# EAGLE design control_board (EAGLE 7.1.0)
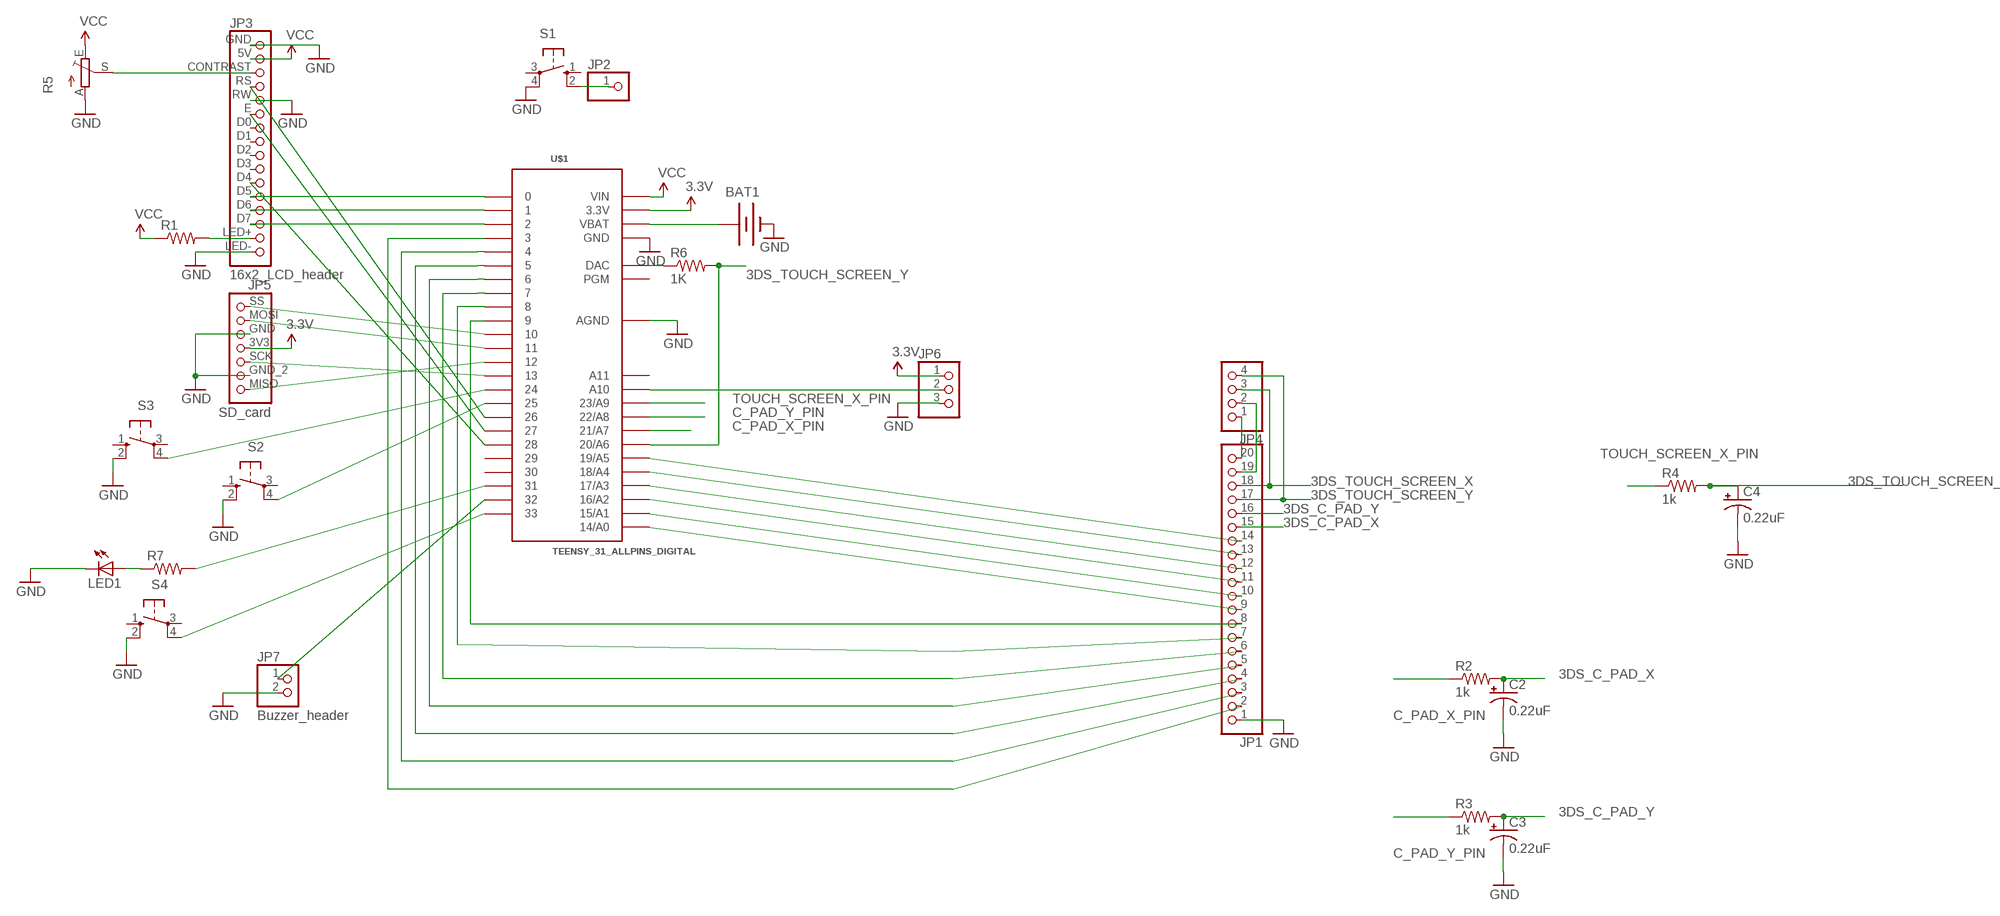
[diagram p0: schematic, sheet 1]

## Parts
BAT1  BATTERY20PTH  [BATTCOM_20MM_PTH]
C2  0.22uF  10UF-25V-20%(PTH)  [CPOL-RADIAL-10UF-25V]
C3  0.22uF  10UF-25V-20%(PTH)  [CPOL-RADIAL-10UF-25V]
C4  0.22uF  10UF-25V-20%(PTH)  [CPOL-RADIAL-10UF-25V]
JP1  PINHD-1X20  [1X20]
JP2  PINHD-1X1  [1X01]
JP3  16x2_LCD_header  PINHD-1X16  [1X16]
JP4  PINHD-1X4  [1X04]
JP5  SD_card  PINHD-1X7  [1X07]
JP6  PINHD-1X3  [1X03]
JP7  Buzzer_header  PINHD-1X2  [1X02]
LED1  LED5MM  [LED5MM]
R1  RESISTOREZ  [AXIAL-0.3EZ]
R2  1k  RESISTORPTH-1/4W-VERT  [AXIAL-0.1]
R3  1k  RESISTORPTH-1/4W-VERT  [AXIAL-0.1]
R4  1k  RESISTORPTH-1/4W-VERT  [AXIAL-0.1]
R5  TRIM_EU-CA6V  [CA6V]
R6  1K  RESISTORPTH-1/4W-VERT  [AXIAL-0.1]
R7  RESISTOREZ  [AXIAL-0.3EZ]
S1  10-XX  [B3F-10XX]
S2  10-XX  [B3F-10XX]
S3  10-XX  [B3F-10XX]
S4  10-XX  [B3F-10XX]
U$1  TEENSY_31_ALLPINS_DIGITAL  [TEENSY_31_ALLPINS_DIGITAL]

## Nets
3.3V: JP5.3V3 JP6.1 U$1.3.3V
3DS_C_PAD_X: C2.1(+) JP1.15 R2.P$2
3DS_C_PAD_Y: C3.1(+) JP1.16 R3.P$2
3DS_TOUCH_SCREEN_X: C4.1(+) JP1.18 JP4.3 R4.P$2
3DS_TOUCH_SCREEN_Y: JP1.17 JP4.4 R6.P$2 U$1.20/A6
C_PAD_X_PIN: R2.P$1 U$1.21/A7
C_PAD_Y_PIN: R3.P$1 U$1.22/A8
GND: BAT1.2(-) C2.2(-) C3.2(-) C4.2(-) JP1.1 JP3.GND JP3.LED- JP3.RW JP5.GND JP5.GND_2 JP6.3 JP7.2 LED1.K(C) R5.A S1.4(P1) S2.2(S1) S3.2(S1) S4.2(S1) U$1.AGND U$1.GND
N$1: JP1.7 U$1.8
N$2: JP1.8 U$1.9
N$3: JP1.9 U$1.14/A0
N$4: JP1.10 U$1.15/A1
N$5: JP1.11 U$1.16/A2
N$6: JP1.12 U$1.17/A3
N$7: JP1.13 U$1.18/A4
N$8: JP1.14 U$1.19/A5
N$9: JP3.LED+ R1.P$2
N$10: JP3.CONTRAST R5.S
N$11: JP5.SS U$1.10
N$12: JP5.MOSI U$1.11
N$13: JP5.MISO U$1.12
N$14: JP2.1 S1.2(S1)
N$15: JP5.SCK U$1.13
N$16: JP6.2 U$1.A10
N$17: JP3.D7 U$1.2
N$18: JP3.D6 U$1.1
N$19: JP3.D5 U$1.0
N$20: JP3.D4 U$1.28
N$21: JP3.E U$1.27
N$22: JP1.2 U$1.3
N$23: JP1.3 U$1.4
N$24: JP1.4 U$1.5
N$25: JP1.5 U$1.6
N$26: JP1.6 U$1.7
N$27: R6.P$1 U$1.RESET(DAC)
N$28: JP3.RS U$1.26
N$29: BAT1.1(+) U$1.VBAT
N$30: S2.4(P1) U$1.25
N$31: S3.4(P1) U$1.24
N$32: S4.4(P1) U$1.33
N$33: R7.P$2 U$1.31
N$34: JP1.20 JP4.1
N$35: JP1.19 JP4.2
N$36: LED1.A R7.P$1
N$37: JP7.1 U$1.32
TOUCH_SCREEN_X_PIN: R4.P$1 U$1.23/A9
VCC: JP3.5V R1.P$1 R5.E U$1.VIN
Unconnected: JP3.D0 JP3.D1 JP3.D2 JP3.D3 S1.1(S) S1.3(P) S2.1(S) S2.3(P) S3.1(S) S3.3(P) S4.1(S) S4.3(P) U$1.29 U$1.30 U$1.A11 U$1.PGM

## Library data of the parts
BAT1 = SparkFun-Electromechanical:BATTERY: Battery Holders Various common sizes : AA, AAA, 20mm coin cell and 12mm coin cell. 20MM_4LEGS, BATT-10373
C2-C4 = SparkFun-Capacitors:10UF-25V-20%(PTH): CAP-08440; PROD_ID: CAP-08440
JP1 = pinhead:PINHD-1X20: PIN HEADER
JP2 = pinhead:PINHD-1X1: PIN HEADER
JP3 = LCD_HEADER:PINHD-1X16: PIN HEADER
JP4 = pinhead:PINHD-1X4: PIN HEADER
JP5 = sd_header:PINHD-1X7: PIN HEADER
JP6 = pinhead:PINHD-1X3: PIN HEADER
JP7 = pinhead:PINHD-1X2: PIN HEADER
LED1 = adafruit:LED: LED OSRAM: - CHIPLED LG R971, LG N971, LY N971, LG Q971, LY Q971, LO R971, LY R971 LH N974, LH R974 LS Q976, LO Q976, LY Q976 LO Q996 - Hyper CHIPLED LW Q18S LB Q993, LB Q99A, LB R99A - SideLED LS A670, LO A670, LY A670, LG A670, LP A670 LB A673, LV A673, LT A673, LW A673 LH A674 LY A675 LS A676, LA A676, LO A676, LY A676, LW A676 LS A679, LY A679, LG A679 - Hyper Micro SIDELED® LS Y876, LA Y876, LO Y876, LY Y876 LT Y87S - SmartLED LW L88C, LW L88S LB L89C, LB L89S, LG L890 LS L89K, LO L89K, LY L89K LS L896, LA L896, LO L896, LY L896 - TOPLED LS T670, LO T670, LY T670, LG T670, LP T670 LSG T670, LSP T670, LSY T670, LOP T670, LYG T670 LG T671, LOG T671, LSG T671 LB T673, LV T673, LT T673, LW T673 LH T674 LS T676, LA T676, LO T676, LY T676, LB T676, LH T676, LSB T676, LW T676 LB T67C, LV T67C, LT T67C, LS T67K, LO T67K, LY T67K, LW E67C LS E67B, LA E67B, LO E67B, LY E67B, LB E67C, LV E67C, LT E67C LW T67C LS T679, LY T679, LG T679 LS T770, LO T770, LY T770, LG T770, LP T770 LB T773, LV T773, LT T773, LW T773 LH T774 LS E675, LA E675, LY E675, LS T675 LS T776, LA T776, LO T776, LY T776, LB T776 LHGB T686 LT T68C, LB T68C - Hyper Mini TOPLED® LB M676 - Mini TOPLED Santana® LG M470 LS M47K, LO M47K, LY M47K Source: http://www.osram.convergy.de/
R1-R4 R6 R7 = SparkFun-Resistors:RESISTOR: Resistor Basic schematic elements and footprints for 0603, 1206, and PTH resistors.
R5 = pot:TRIM_EU-: POTENTIOMETER
S1-S4 = switch-omron:10-XX: OMRON SWITCH; MPN: B3F-1000; OC_FARNELL: 176432; OC_NEWARK: 36M3542
U$1 = Teensy3.0:TEENSY_31_ALLPINS_DIGITAL

## Board
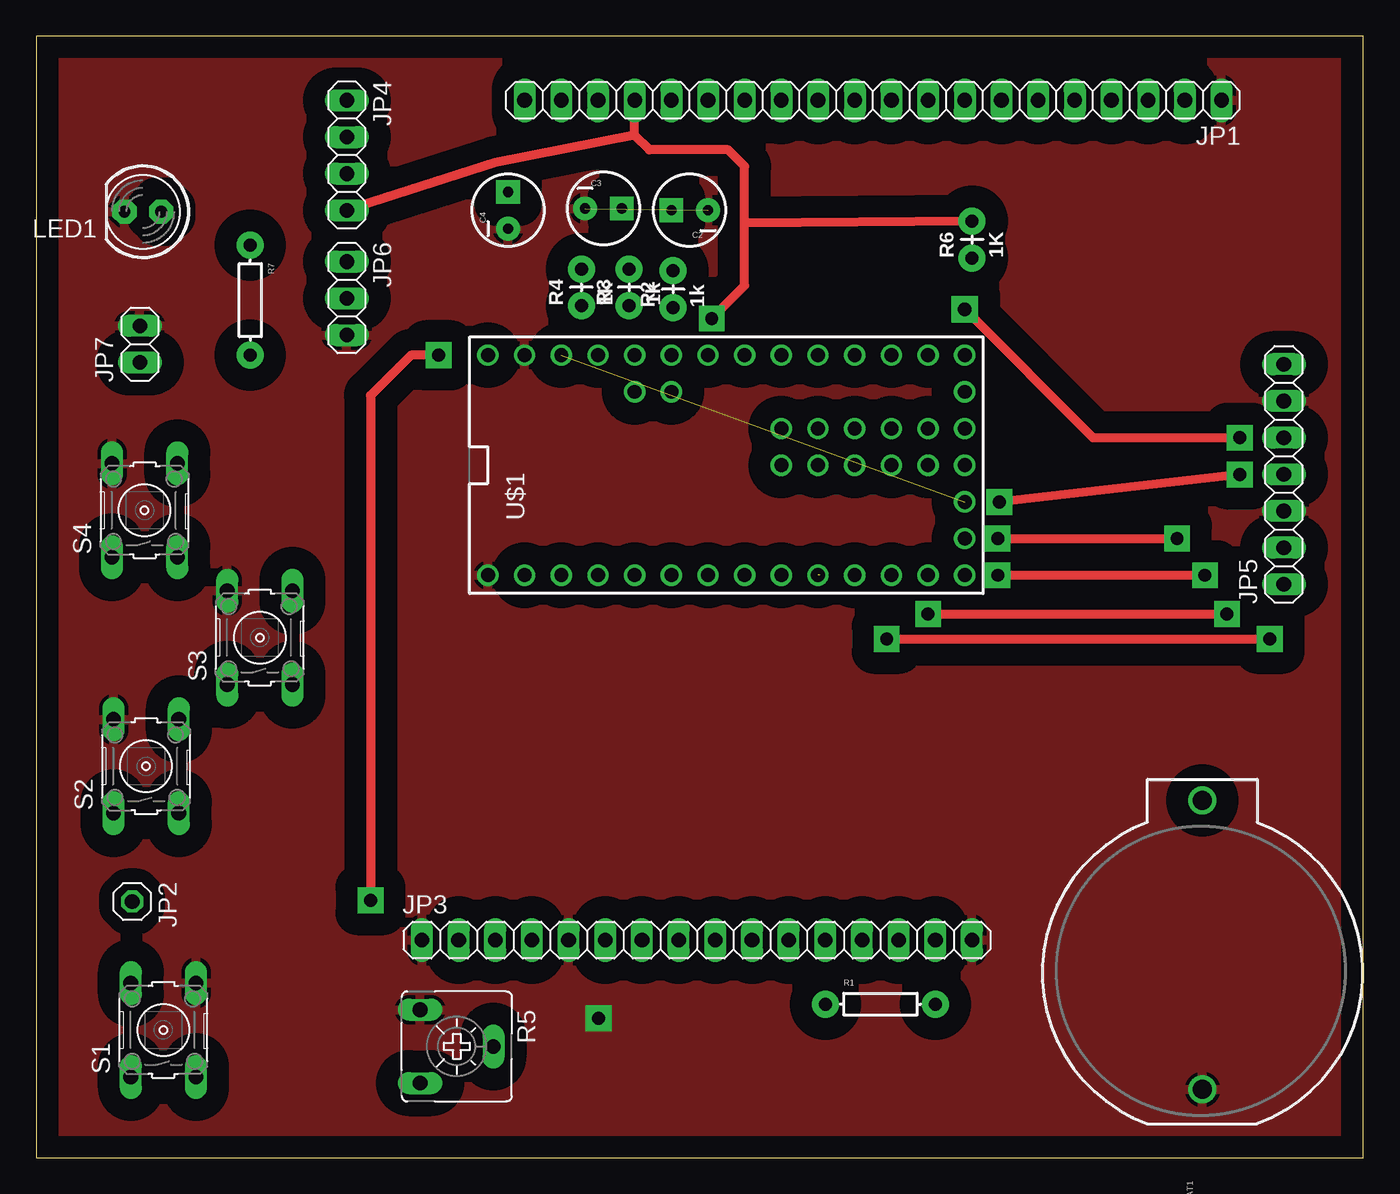
[diagram p1: board, top side]
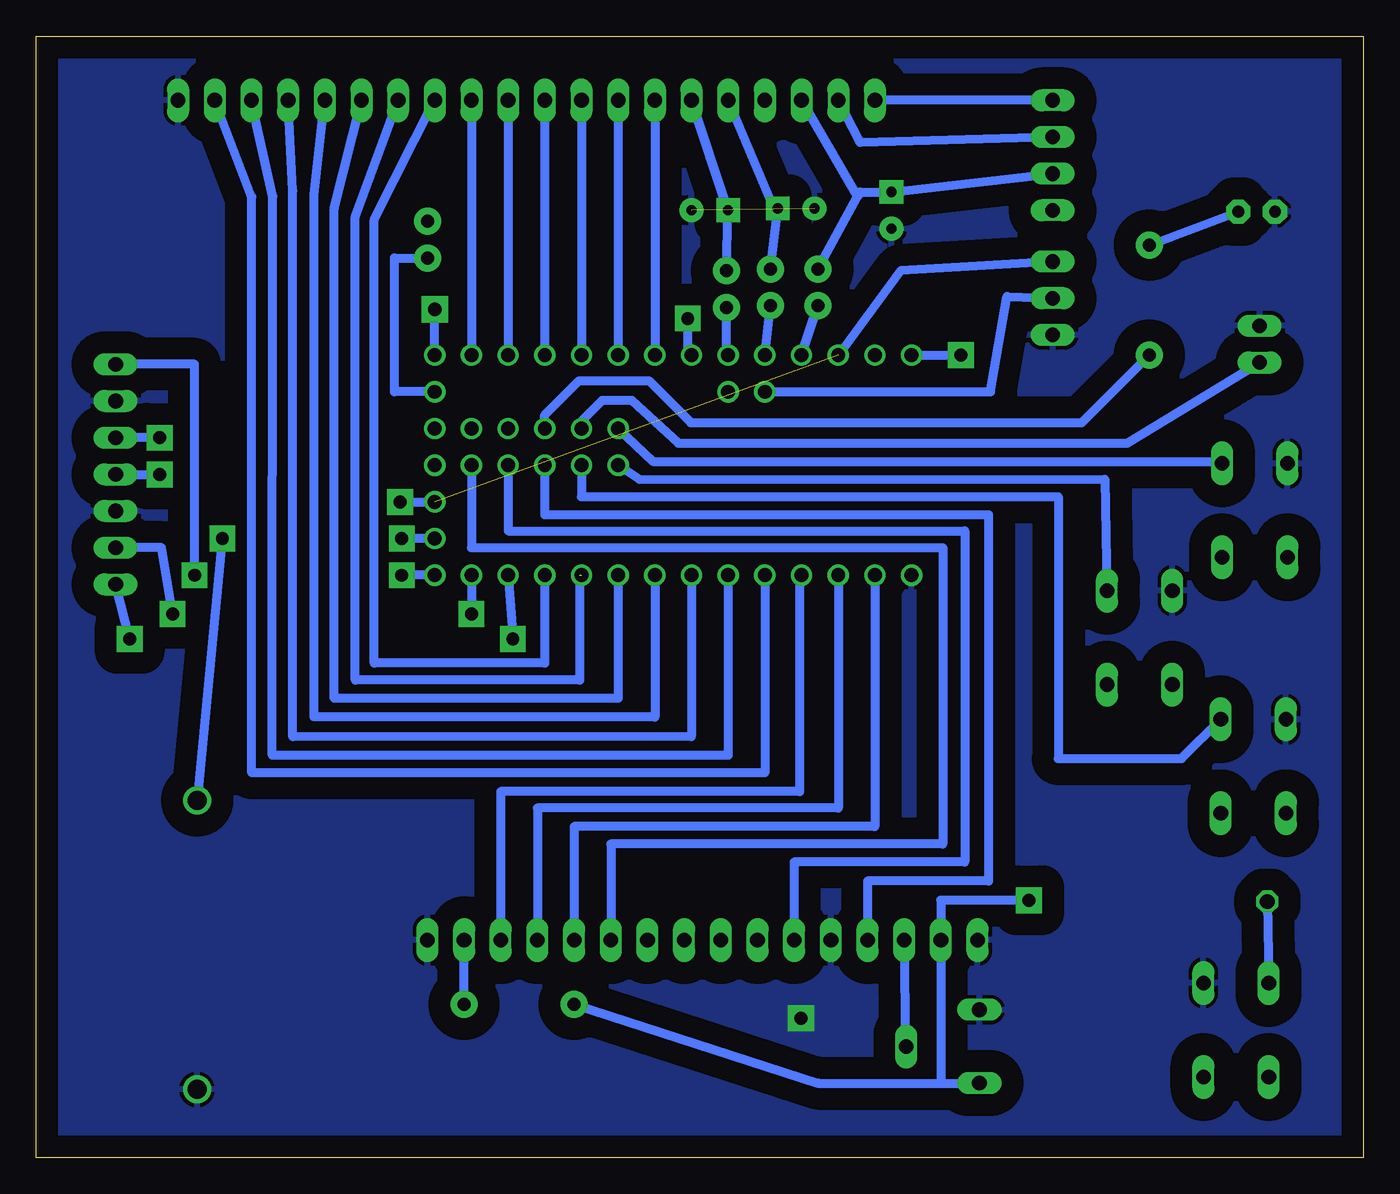
[diagram p2: board, bottom side, seen from below]

Size 91.92 x 77.67 mm. Coordinates in mm from the lower left corner, seen from the top.
Outline: 0,0 91.92,0 91.92,77.67 0,77.67 0,0
Copper layers (1*16): Top 0.035mm / dielectric 1.5mm / Bottom 0.035mm
Design rules "MWSEagleDesignRules2": minimum track width 13mil, minimum drill 22mil, track to track 13mil, track to pad 13mil, pad to pad 13mil, via to via 13mil, smd to smd 8mil, copper to edge 40mil, drill to drill 8mil, minimum pad ring 10mil, minimum via ring 8mil, stop-mask expansion 4mil, vias tented up to drill 0mil, thermal gap 10mil

### Footprints (pad centres in the part's own frame; a part is rotated, then mirrored left to right if it is on the bottom)
BATTCOM_20MM_PTH = drill 1.3: 1 11.85,0; 2 -8.15,0
CPOL-RADIAL-10UF-25V = drill 0.7 pad 1.651 square: 1 1.27,0 | drill 0.7 pad 1.651: 2 -1.27,0
1X20 = drill 1.016 long: 1 -24.13,0; 2 -21.59,0; 3 -19.05,0; 4 -16.51,0; 5 -13.97,0; 6 -11.43,0; 7 -8.89,0; 8 -6.35,0; 9 -3.81,0; 10 -1.27,0; 11 1.27,0; 12 3.81,0; 13 6.35,0; 14 8.89,0; 15 11.43,0; 16 13.97,0; 17 16.51,0; 18 19.05,0; 19 21.59,0; 20 24.13,0
1X01 = drill 1.016 octagon: 1 0,0
1X16 = drill 1.016 long: 5V -16.51,0; CONTRAST -13.97,0; D0 -3.81,0; D1 -1.27,0; D2 1.27,0; D3 3.81,0; D4 6.35,0; D5 8.89,0; D6 11.43,0; D7 13.97,0; E -6.35,0; GND -19.05,0; LED+ 16.51,0; LED- 19.05,0; RS -11.43,0; RW -8.89,0
1X04 = drill 1.016 long: 1 -3.81,0; 2 -1.27,0; 3 1.27,0; 4 3.81,0
1X07 = drill 1.016 long: 3V3 0,0; GND -2.54,0; GND_2 5.08,0; MISO 7.62,0; MOSI -5.08,0; SCK 2.54,0; SS -7.62,0
1X03 = drill 1.016 long: 1 -2.54,0; 2 0,0; 3 2.54,0
1X02 = drill 1.016 long: 1 -1.27,0; 2 1.27,0
LED5MM = drill 0.813 pad 1.676 octagon: A -1.27,0; K 1.27,0
AXIAL-0.3EZ = drill 0.9 pad 1.88: P$1 -3.81,0; P$2 3.81,0
AXIAL-0.1 = drill 0.9 pad 1.88: P$1 0,0; P$2 2.54,0
CA6V = drill 1.016 long: A -2.54,-2.54; E 2.54,-2.54; S 0,2.54
B3F-10XX = drill 1.016 long: 1 -3.251,2.261; 2 3.251,2.261; 3 -3.251,-2.261; 4 3.251,-2.261
TEENSY_31_ALLPINS_DIGITAL = drill 0.965: 0 -7.62,15.24; 1 -7.62,12.7; 2 -7.62,10.16; 3 -7.62,7.62; 3.3V 7.62,12.7; 3.3V1 -2.54,-15.24; 4 -7.62,5.08; 5 -7.62,2.54; 6 -7.62,0; 7 -7.62,-2.54; 8 -7.62,-5.08; 9 -7.62,-7.62; 10 -7.62,-10.16; 11 -7.62,-12.7; 12 -7.62,-15.24; 13 7.62,-15.24; 14/A0 7.62,-12.7; 15/A1 7.62,-10.16; 16/A2 7.62,-7.62; 17/A3 7.62,-5.08; 18/A4 7.62,-2.54; 19/A5 7.62,0; 20/A6 7.62,2.54; 21/A7 7.62,5.08; 22/A8 7.62,7.62; 23/A9 7.62,10.16; 24 0,-2.54; 25 0,-5.08; 26 0,-7.62; 27 0,-10.16; 28 0,-12.7; 29 2.54,-12.7; 30 2.54,-10.16; 31 2.54,-7.62; 32 2.54,-5.08; 33 2.54,-2.54; A10 5.08,7.62; A11 5.08,5.08; AGND 7.62,15.24; GND -7.62,17.78; GND1 0,-15.24; PGM 2.54,-15.24; RESET 5.08,-15.24; VBAT -5.08,-15.24; VIN 7.62,17.78

### Placement (x,y rotation side)
BAT1  80.77,12.88 90 top
C2  45.26,65.61 180 top
C3  39.29,65.74 0 top
C4  32.69,65.61 90 top
JP1  57.96,73.23 180 top
JP2  6.65,17.73 270 top
JP3  45.77,15.06 0 top
JP4  21.51,69.42 270 top
JP5  86.41,47.32 90 top
JP6  21.51,59.51 270 top
JP7  7.19,56.34 90 top
LED1  7.39,65.51 180 top
R1  58.47,10.62 0 top
R2  44.12,58.88 90 top
R3  41.07,59 90 top
R4  37.77,59 90 top
R5  29.13,7.7 270 top
R6  64.82,62.31 90 top
R7  14.83,59.39 270 top
S1  8.81,8.84 90 top
S2  7.62,27.1 90 top
S3  15.49,36.02 90 top
S4  7.52,44.83 90 top
U$1  49.07,47.96 90 top

### Tracks (layer width: path | path; a pad name or v marks a point on that pad's centre or on a via)
3.3V  (via drill 0.9 pad 1.42)  (1 unrouted)
  Top 0.61: v83.36,47.32 v66.73,45.41
  Bottom 0.61: JP5.3V3 v83.36,47.32 | v66.73,45.41 64.31,45.41 | JP6.1 32.05,61.42 U$1.3.3V
3DS_C_PAD_X
  Bottom 0.61: R2.P$2 C2.1 JP1.15
3DS_C_PAD_Y
  Bottom 0.61: R3.P$2 40.63,65.2 | 40.63,65.2 C3.1 | JP1.16 40.63,65.2
3DS_TOUCH_SCREEN_X
  Bottom 0.61: R4.P$2 35.02,66.56 | 35.02,66.56 34.85,66.88 C4.1 JP4.3 | JP1.18 35.02,66.56
3DS_TOUCH_SCREEN_Y  (via drill 0.89 pad 1.52)
  Top 0.61: v46.79,58.12 49.07,60.4 49.07,64.72 | 49.07,64.72 49.07,68.66 47.93,69.8 42.47,69.8 41.45,70.81 | 41.45,70.81 JP1.17 | 41.45,70.81 31.8,68.91 JP4.4 | R6.P$2 49.07,64.72
  Bottom 0.61: U$1.20/A6 46.79,55.58 v46.79,58.12
C_PAD_X_PIN
  Bottom 0.61: U$1.21/A7 44.12,55.58 R2.P$1
C_PAD_Y_PIN
  Bottom 0.61: U$1.22/A8 R3.P$1
GND  (via drill 0.9)  (1 unrouted)
  other vias: 38.96,9.65
  pour Bottom (isolate 1.524): -0.28,77.95 0,0 92.35,0.1 92.08,78.05
  pour Top (isolate 1.524): -0.13,0.13 92.08,-0.3 92.2,77.65 -0.1,77.8
N$1  (1 unrouted)
  Bottom 0.61: JP1.7 69.83,65.18 69.83,33.07 54.28,33.07 54.28,40.34
N$2
  Bottom 0.61: JP1.8 68.5,64.97 68.5,34.24 56.69,34.24 U$1.9
N$3
  Bottom 0.61: JP1.9 U$1.14/A0
N$4
  Bottom 0.61: JP1.10 U$1.15/A1
N$5
  Bottom 0.61: JP1.11 U$1.16/A2
N$6
  Bottom 0.61: JP1.12 U$1.17/A3
N$7
  Bottom 0.61: JP1.13 U$1.18/A4
N$8
  Bottom 0.61: JP1.14 U$1.19/A5
N$9
  Bottom 0.61: R1.P$2 JP3.LED+
N$10
  Bottom 0.61: R5.S JP3.CONTRAST
N$11  (via drill 0.89 pad 1.52)
  Top 0.61: v58.9,35.92 v85.45,35.92
  Bottom 0.61: U$1.10 v58.9,35.92 | v85.45,35.92 JP5.SS
N$12  (via drill 0.89 pad 1.52)
  Top 0.61: v61.77,37.64 v82.47,37.64
  Bottom 0.61: U$1.11 v61.77,37.64 | v82.47,37.64 83.24,42.24 JP5.MOSI
N$13  (via drill 0.89 pad 1.52)
  Top 0.61: v66.6,40.34 v80.95,40.34
  Bottom 0.61: U$1.12 v66.6,40.34 | v80.95,40.34 80.95,54.94 JP5.MISO
N$14
  Bottom 0.61: JP2.1 S1.2
N$15  (via drill 0.89 pad 1.52, 0.91 pad 1.52)
  Top 0.61: v64.31,58.75 73.2,49.86 v83.36,49.86
  Bottom 0.61: U$1.13 v64.31,58.75 | v83.36,49.86 JP5.SCK
N$16
  Bottom 0.61: U$1.A10 25.83,53.03 24.69,59.64 JP6.2
N$17
  Bottom 0.61: U$1.2 39.04,40.34 39.04,25.35 59.74,25.35 JP3.D7
N$18
  Bottom 0.61: U$1.1 36.37,24.21 57.2,24.21 JP3.D6
N$19
  Bottom 0.61: U$1.0 33.83,22.94 54.66,22.94 JP3.D5
N$20
  Bottom 0.61: U$1.28 61.77,42.24 29.13,42.24 29.13,21.72 52.12,21.72 JP3.D4
N$21
  Bottom 0.61: U$1.27 59.23,43.41 27.61,43.41 27.61,20.47 39.42,20.47 JP3.E
N$22
  Bottom 0.61: JP1.2 76.99,66.52 76.99,26.64 41.45,26.64 U$1.3
N$23
  Bottom 0.61: JP1.3 75.54,66.57 75.56,27.86 43.99,27.86 U$1.4
N$24
  Bottom 0.61: JP1.4 74.14,66.95 74.14,29.13 46.53,29.16 U$1.5
N$25
  Bottom 0.61: JP1.5 72.67,66.7 72.67,30.53 49.07,30.5 U$1.6
N$26
  Bottom 0.61: JP1.6 71.27,65.73 71.27,31.8 51.61,31.8 U$1.7
N$27
  Bottom 0.61: R6.P$1 67.11,62.31 67.11,53.03 U$1.RESET
N$28
  Bottom 0.61: U$1.26 56.69,44.53 25.96,44.53 25.96,19.15 34.34,19.15 JP3.RS
N$29  (via drill 0.89 pad 1.52)
  Top 0.61: v66.6,42.88 v79.02,42.88
  Bottom 0.61: U$1.VBAT v66.6,42.88 | v79.02,42.88 BAT1.1
N$30
  Bottom 0.61: U$1.25 54.15,45.77 21.13,45.77 21.13,27.64 12.6,27.64 S2.4
N$31
  Bottom 0.61: S3.4 17.91,46.99 50.14,46.97 U$1.24
N$32
  Bottom 0.61: U$1.33 49.2,48.21 10.29,48.21 S4.4
N$33
  Bottom 0.61: U$1.31 56.69,51.41 54.3,53.8 49.48,53.8 46.58,50.9 19.51,50.9 R7.P$2
N$34
  Bottom 0.61: JP4.1 JP1.20
N$35
  Bottom 0.61: JP4.2 34.85,70.31 JP1.19
N$36
  Bottom 0.61: R7.P$1 LED1.A
N$37
  Bottom 0.61: U$1.32 54.15,51 52.7,52.45 50.67,52.45 47.45,49.48 16.36,49.48 JP7.1
TOUCH_SCREEN_X_PIN
  Bottom 0.61: U$1.23/A9 R4.P$1
VCC  (via drill 0.9)
  Top 0.61: v27.86,55.58 25.96,55.58 23.16,52.78 v23.16,17.83
  Bottom 0.61: U$1.VIN v27.86,55.58 | v23.16,17.83 29.26,17.83 JP3.5V 29.26,5.16 | 29.26,5.16 R5.E | R1.P$1 37.77,5.16 29.26,5.16